# EAGLE design S7G7_footprint_Power_Meter_Only_v1p20 (EAGLE 9.6.2)
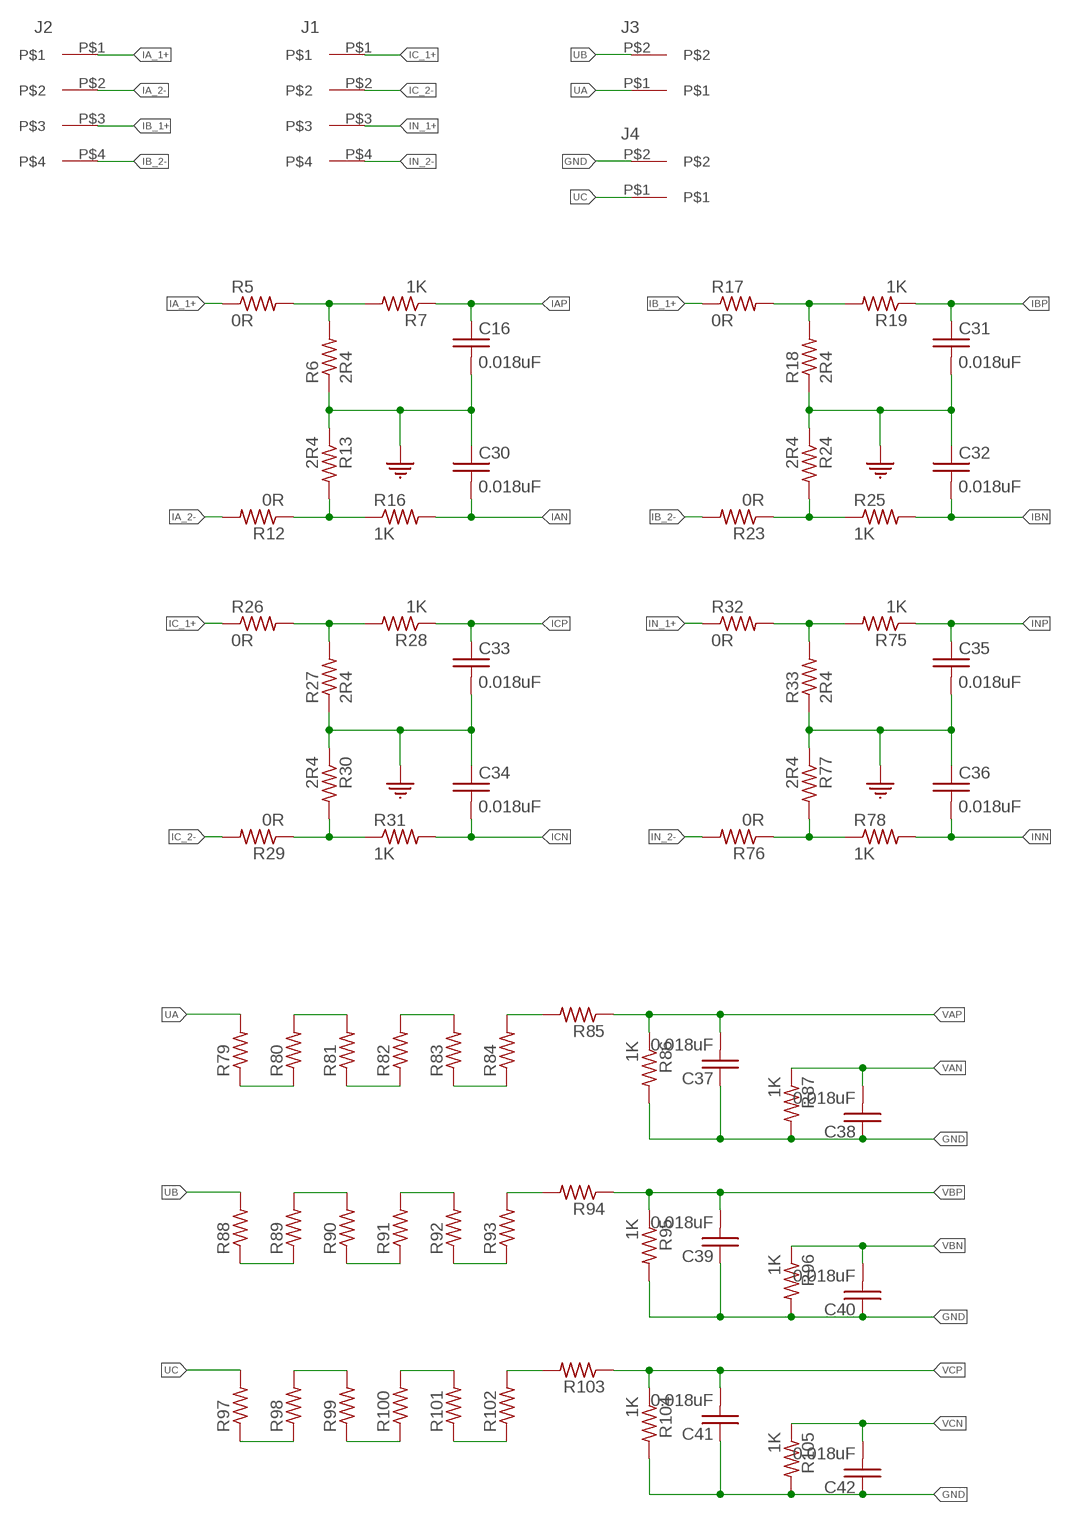
[diagram p0: schematic, sheet 1, part 1 of 2]
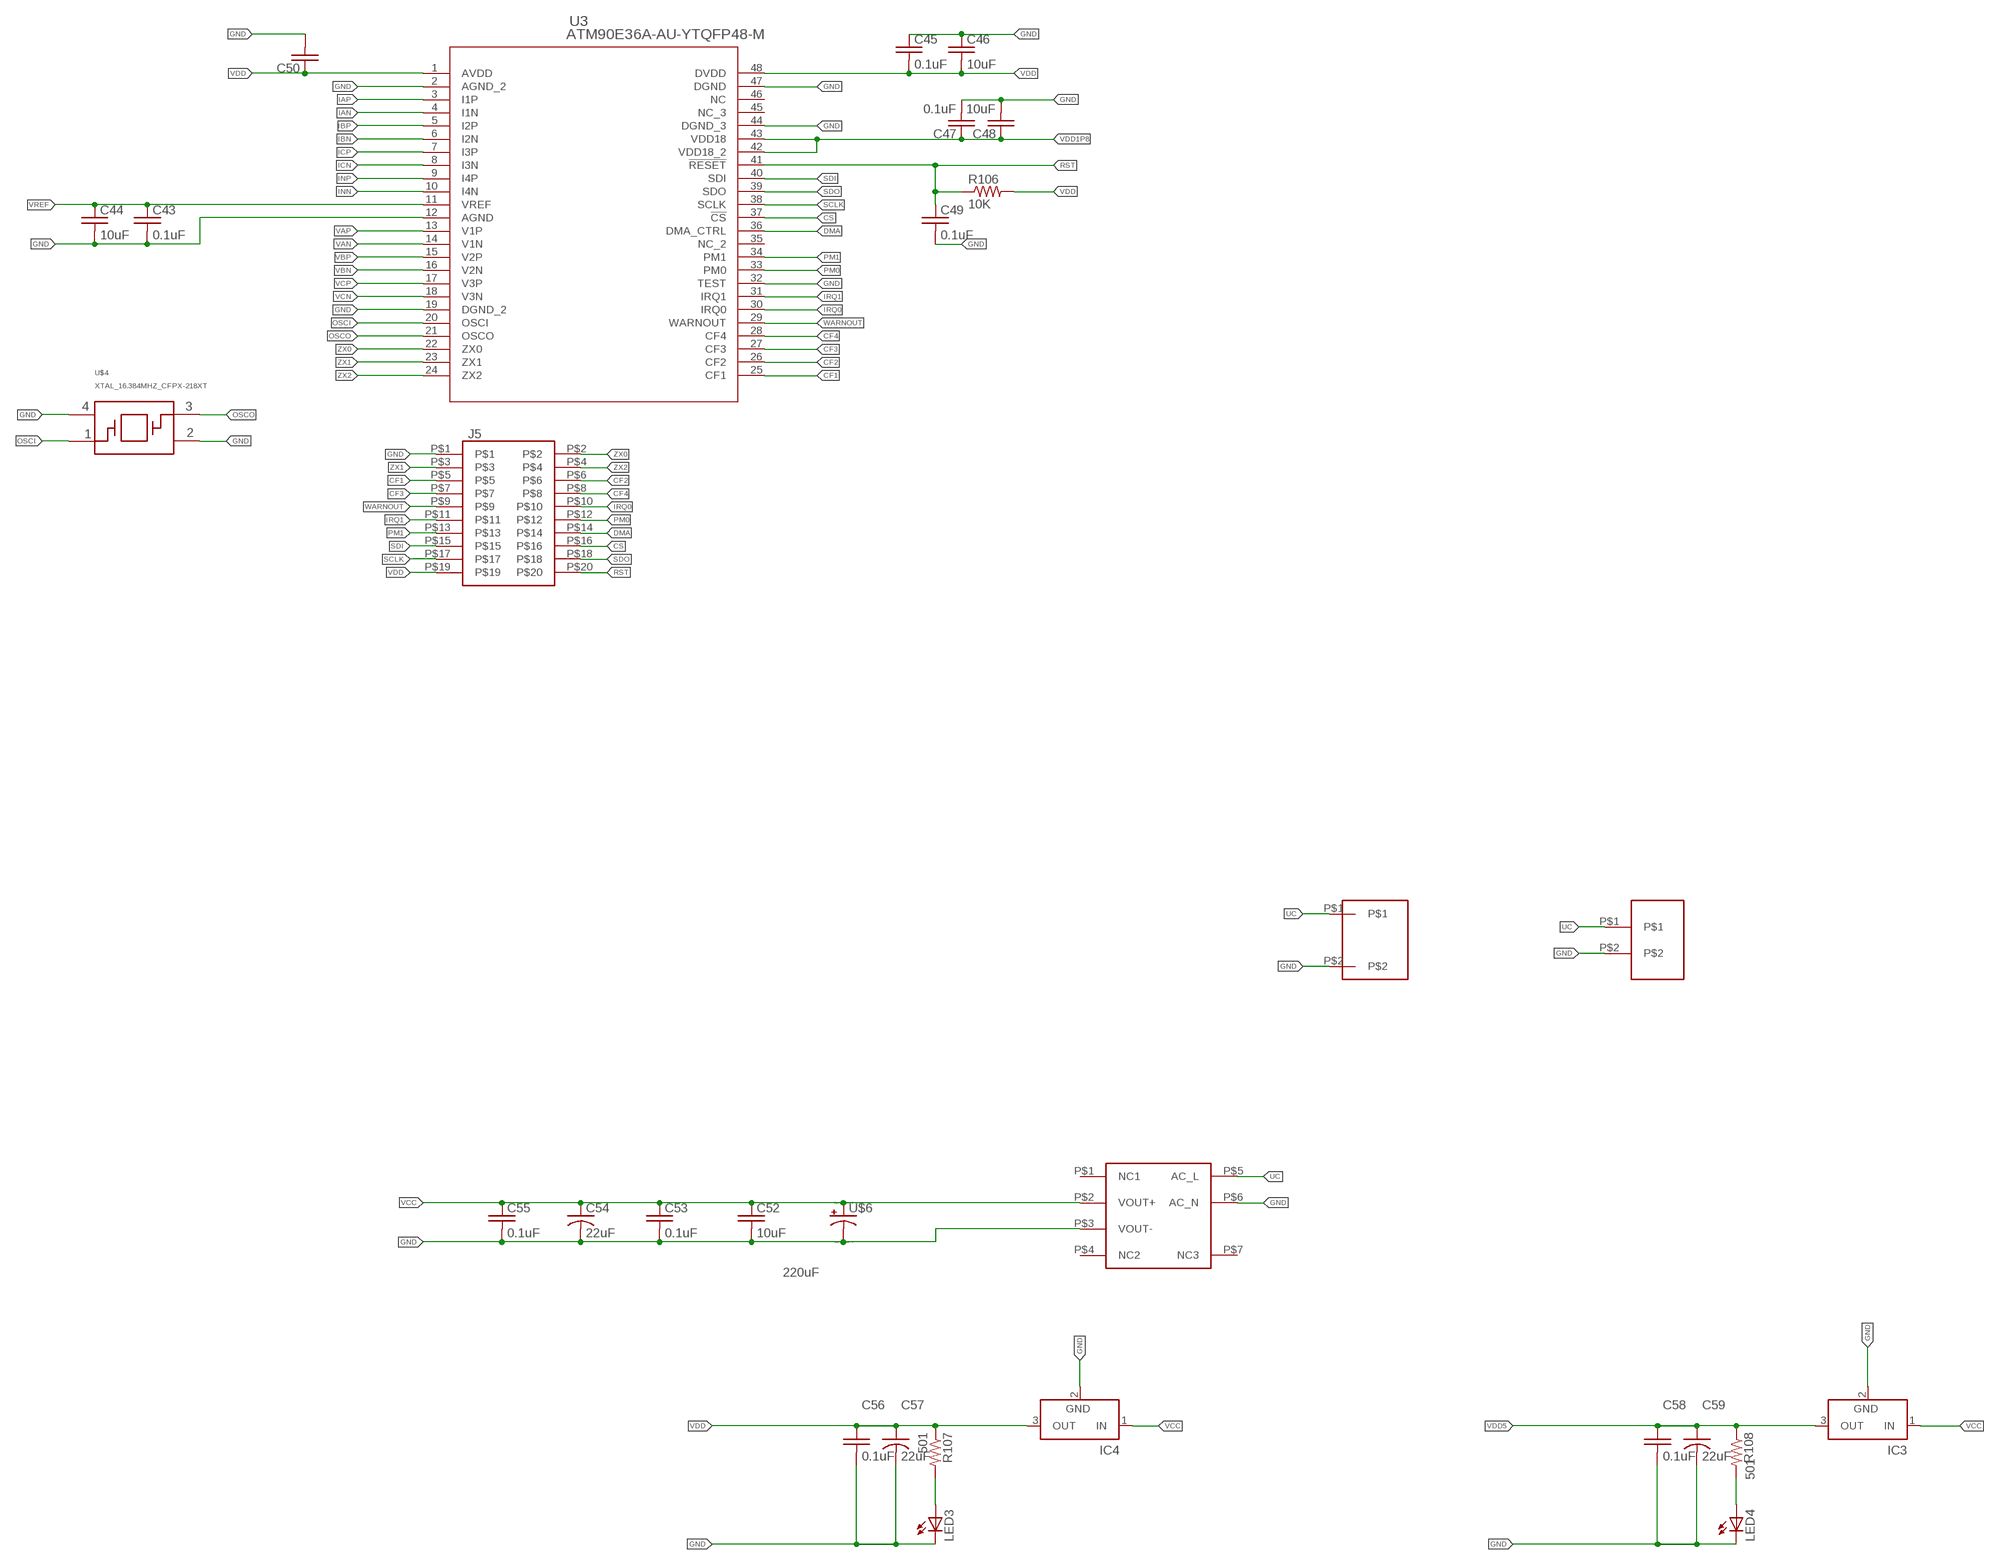
[diagram p1: schematic, sheet 1, part 2 of 2]

## Parts
C16  0.018uF  C_0402  [0402]
C30  0.018uF  C_0402  [0402]
C31  0.018uF  C_0402  [0402]
C32  0.018uF  C_0402  [0402]
C33  0.018uF  C_0402  [0402]
C34  0.018uF  C_0402  [0402]
C35  0.018uF  C_0402  [0402]
C36  0.018uF  C_0402  [0402]
C37  0.018uF  C_0402  [0402]
C38  0.018uF  C_0402  [0402]
C39  0.018uF  C_0402  [0402]
C40  0.018uF  C_0402  [0402]
C41  0.018uF  C_0402  [0402]
C42  0.018uF  C_0402  [0402]
C43  0.1uF  C_0402  [0402]
C44  10uF  C_0402  [0402]
C45  0.1uF  C_0402  [0402]
C46  10uF  C_0402  [0402]
C47  0.1uF  C_0402  [0402]
C48  10uF  C_0402  [0402]
C49  0.1uF  C_0402  [0402]
C50  C_0402  [0402]
C51  CAP_THIN_FILM_TDK_32922CAP  [CAP_THIN_FILM_32922]
C52  10uF  C_0402  [0402]
C53  0.1uF  C_0402  [0402]
C54  22uF  C-USC1206  [C1206]
C55  0.1uF  C_0402  [0402]
C56  0.1uF  C_0402  [0402]
C57  22uF  C-USC1206  [C1206]
C58  0.1uF  C_0402  [0402]
C59  22uF  C-USC1206  [C1206]
IC3  LT1129CST5  [SOT223]
IC4  LT1129CST3  [SOT223]
J1  3.81MM_1_X_4_RT_ANGLE_PLUG_HEADER  [1X4_3.81MM_PITCH]
J2  3.81MM_1_X_4_RT_ANGLE_PLUG_HEADER  [1X4_3.81MM_PITCH]
J3  3.81MM_1_X_2_RT_ANGLE_PLUG_HEADER  [2_3.81MM_PITCH]
J4  3.81MM_1_X_2_RT_ANGLE_PLUG_HEADER  [2_3.81MM_PITCH]
J5  2_X_10_HEADER_GENERIC  [2_X_10_.1_INCH]
LED3  LED_0805_GREEN  [LED_0805_GREEN]
LED4  LED_0805_GREEN  [LED_0805_GREEN]
R5  0R  R_0402  [0402]
R6  2R4  R_0402  [0402]
R7  1K  R_0402  [0402]
R12  0R  R_0402  [0402]
R13  2R4  R_0402  [0402]
R16  1K  R_0402  [0402]
R17  0R  R_0402  [0402]
R18  2R4  R_0402  [0402]
R19  1K  R_0402  [0402]
R23  0R  R_0402  [0402]
R24  2R4  R_0402  [0402]
R25  1K  R_0402  [0402]
R26  0R  R_0402  [0402]
R27  2R4  R_0402  [0402]
R28  1K  R_0402  [0402]
R29  0R  R_0402  [0402]
R30  2R4  R_0402  [0402]
R31  1K  R_0402  [0402]
R32  0R  R_0402  [0402]
R33  2R4  R_0402  [0402]
R75  1K  R_0402  [0402]
R76  0R  R_0402  [0402]
R77  2R4  R_0402  [0402]
R78  1K  R_0402  [0402]
R79  R_0402  [0402]
R80  R_0402  [0402]
R81  R_0402  [0402]
R82  R_0402  [0402]
R83  R_0402  [0402]
R84  R_0402  [0402]
R85  R_0402  [0402]
R86  1K  R_0402  [0402]
R87  1K  R_0402  [0402]
R88  R_0402  [0402]
R89  R_0402  [0402]
R90  R_0402  [0402]
R91  R_0402  [0402]
R92  R_0402  [0402]
R93  R_0402  [0402]
R94  R_0402  [0402]
R95  1K  R_0402  [0402]
R96  1K  R_0402  [0402]
R97  R_0402  [0402]
R98  R_0402  [0402]
R99  R_0402  [0402]
R100  R_0402  [0402]
R101  R_0402  [0402]
R102  R_0402  [0402]
R103  R_0402  [0402]
R104  1K  R_0402  [0402]
R105  1K  R_0402  [0402]
R106  10K  R_0402  [0402]
R107  501  R_0402  [0402]
R108  501  R_0402  [0402]
U3  ATM90E36A-AU-YTQFP48-M  [TQFP48-M]
U4  TMLM_04109  [TMLM04]
U$4  XTAL_16.384MHZ_CFPX-218XT  [XTAL_2.5X2.0]
U$5  VAR_10MM_VDRUS10  [VAR_10MM_VDRUS10]
U$6  220uF  C_AL_ELECTROLYTIC_SMD_220UF  [C_AL_ELECTROLYTIC_SMD_220UF]

## Nets
CF1: J5.P$5 U3.25(CF1)
CF2: J5.P$6 U3.26(CF2)
CF3: J5.P$7 U3.27(CF3)
CF4: J5.P$8 U3.28(CF4)
CS: J5.P$16 U3.37(!CS)
DMA: J5.P$14 U3.36(DMA_CTRL)
GND: C16.P$2 C30.P$1 C31.P$2 C32.P$1 C33.P$2 C34.P$1 C35.P$2 C36.P$1 C37.P$1 C38.P$1 C39.P$1 C40.P$1 C41.P$1 C42.P$1 C43.P$2 C44.P$2 C45.P$1 C46.P$1 C47.P$2 C48.P$2 C49.P$2 C50.P$2 C51.P$2 C52.P$2 C53.P$2 C54.2 C55.P$2 C56.P$2 C57.2 C58.P$2 C59.2 IC3.2(GND) IC4.2(GND) J4.P$2 J5.P$1 LED3.C LED4.C R6.P$1 R13.P$1 R18.P$1 R24.P$1 R27.P$1 R30.P$1 R33.P$1 R77.P$1 R86.P$2 R87.P$2 R95.P$2 R96.P$2 R104.P$2 R105.P$2 U3.2(AGND_2) U3.12(AGND) U3.19(DGND_2) U3.32(TEST) U3.44(DGND_3) U3.47(DGND) U4.P$3(VOUT-) U4.P$6(AC_N) U$4.2 U$4.4 U$5.P$2 U$6.N-(-)
IA_1+: J2.P$1 R5.P$1
IA_2-: J2.P$2 R12.P$2
IAN: C30.P$2 R16.P$2 U3.4(I1N)
IAP: C16.P$1 R7.P$1 U3.3(I1P)
IB_1+: J2.P$3 R17.P$1
IB_2-: J2.P$4 R23.P$2
IBN: C32.P$2 R25.P$2 U3.6(I2N)
IBP: C31.P$1 R19.P$1 U3.5(I2P)
IC_1+: J1.P$1 R26.P$1
IC_2-: J1.P$2 R29.P$2
ICN: C34.P$2 R31.P$2 U3.8(I3N)
ICP: C33.P$1 R28.P$1 U3.7(I3P)
IN_1+: J1.P$3 R32.P$1
IN_2-: J1.P$4 R76.P$2
INN: C36.P$2 R78.P$2 U3.10(I4N)
INP: C35.P$1 R75.P$1 U3.9(I4P)
IRQ0: J5.P$10 U3.30(IRQ0)
IRQ1: J5.P$11 U3.31(IRQ1)
N$4: R5.P$2 R6.P$2 R7.P$2
N$5: R12.P$1 R13.P$2 R16.P$1
N$6: R17.P$2 R18.P$2 R19.P$2
N$7: R23.P$1 R24.P$2 R25.P$1
N$8: R26.P$2 R27.P$2 R28.P$2
N$34: R29.P$1 R30.P$2 R31.P$1
N$35: R32.P$2 R33.P$2 R75.P$2
N$36: R76.P$1 R77.P$2 R78.P$1
N$37: R79.P$1 R80.P$1
N$38: R80.P$2 R81.P$2
N$39: R81.P$1 R82.P$1
N$40: R82.P$2 R83.P$2
N$41: R83.P$1 R84.P$1
N$42: R84.P$2 R85.P$2
N$43: R88.P$1 R89.P$1
N$44: R89.P$2 R90.P$2
N$45: R90.P$1 R91.P$1
N$46: R91.P$2 R92.P$2
N$47: R92.P$1 R93.P$1
N$48: R93.P$2 R94.P$2
N$49: R97.P$1 R98.P$1
N$50: R98.P$2 R99.P$2
N$51: R99.P$1 R100.P$1
N$52: R100.P$2 R101.P$2
N$53: R101.P$1 R102.P$1
N$54: R102.P$2 R103.P$2
N$55: LED3.A R107.P$2
N$56: LED4.A R108.P$2
OSCI: U3.20(OSCI) U$4.1
OSCO: U3.21(OSCO) U$4.3
PM0: J5.P$12 U3.33(PM0)
PM1: J5.P$13 U3.34(PM1)
RST: C49.P$1 J5.P$20 R106.P$1 U3.41(!RESET)
SCLK: J5.P$17 U3.38(SCLK)
SDI: J5.P$15 U3.40(SDI)
SDO: J5.P$18 U3.39(SDO)
UA: J3.P$1 R79.P$2
UB: J3.P$2 R88.P$2
UC: C51.P$1 J4.P$1 R97.P$2 U4.P$5(AC_L) U$5.P$1
VAN: C38.P$2 R87.P$1 U3.14(V1N)
VAP: C37.P$2 R85.P$1 R86.P$1 U3.13(V1P)
VBN: C40.P$2 R96.P$1 U3.16(V2N)
VBP: C39.P$2 R94.P$1 R95.P$1 U3.15(V2P)
VCC: C52.P$1 C53.P$1 C54.1 C55.P$1 IC3.1(IN) IC4.1(IN) U4.P$2(VOUT+) U$6.P+(+)
VCN: C42.P$2 R105.P$1 U3.18(V3N)
VCP: C41.P$2 R103.P$1 R104.P$1 U3.17(V3P)
VDD: C45.P$2 C46.P$2 C50.P$1 C56.P$1 C57.1 IC4.3(OUT) J5.P$19 R106.P$2 R107.P$1 U3.1(AVDD) U3.48(DVDD)
VDD1P8: C47.P$1 C48.P$1 U3.42(VDD18_2) U3.43(VDD18)
VDD5: C58.P$1 C59.1 IC3.3(OUT) R108.P$1
VREF: C43.P$1 C44.P$1 U3.11(VREF)
WARNOUT: J5.P$9 U3.29(WARNOUT)
ZX0: J5.P$2 U3.22(ZX0)
ZX1: J5.P$3 U3.23(ZX1)
ZX2: J5.P$4 U3.24(ZX2)
Unconnected: U3.35(NC_2) U3.45(NC_3) U3.46(NC) U4.P$1(NC1) U4.P$4(NC2) U4.P$7(NC3)

## Power pins joined to a net without a drawn wire
GND: IC3.4(GND) IC4.4(GND)

## Library data of the parts
C16 C30-C50 C52 C53 C55 C56 C58 = 3D_MIG_Controller:C_0402
C51 = 3D_MIG_Controller:CAP_THIN_FILM_TDK_32922
C54 C57 C59 = 3D_MIG_Controller:C-US: CAPACITOR, American symbol
IC3 = 3D_MIG_Controller:LT1129CST5: VOLTAGE REGULATOR with shutdown; MPN: LT1129CST-5#PBF; OC_FARNELL: 1663375; OC_NEWARK: 57M2069
IC4 = 3D_MIG_Controller:LT1129CST3: VOLTAGE REGULATOR with shutdown; MPN: LT1129CST-5#PBF; OC_FARNELL: 1663375; OC_NEWARK: 57M2069
J1 J2 = 3D_MIG_Controller:3.81MM_1_X_4_RT_ANGLE_PLUG_HEADER
J3 J4 = 3D_MIG_Controller:3.81MM_1_X_2_RT_ANGLE_PLUG_HEADER
J5 = 3D_MIG_Controller:2_X_10_HEADER_GENERIC
LED3 LED4 = 3D_MIG_Controller:LED_0805_GREEN
R5-R7 R12 R13 R16-R19 R23-R33 R75-R108 = 3D_MIG_Controller:R_0402
U3 = 3D_MIG_Controller:ATM90E36A-AU-Y; MANUFACTURER_PART_NUMBER: ATM90E36AAUY; VENDOR: Atmel
U4 = 3D_MIG_Controller:TMLM_04109
U$4 = 3D_MIG_Controller:XTAL_16.384MHZ_CFPX-218
U$5 = 3D_MIG_Controller:VAR_10MM_VDRUS10
U$6 = 3D_MIG_Controller:C_AL_ELECTROLYTIC_SMD_220UF

## Board
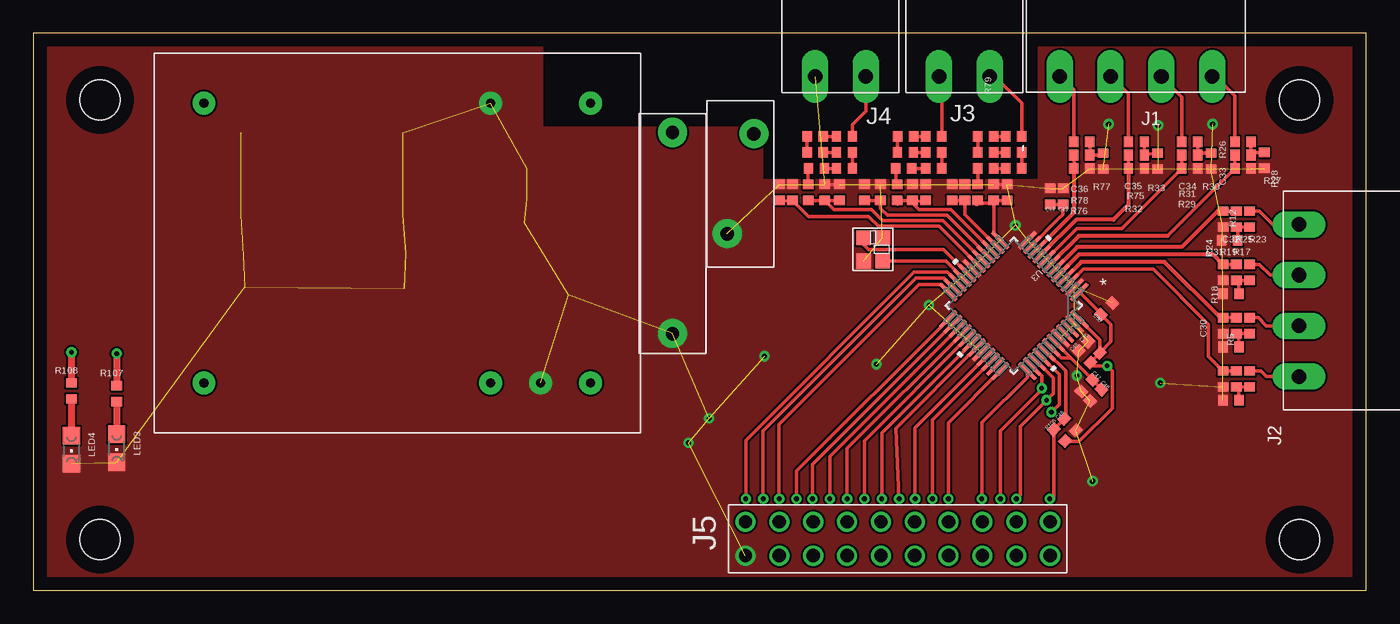
[diagram p2: board, top side]
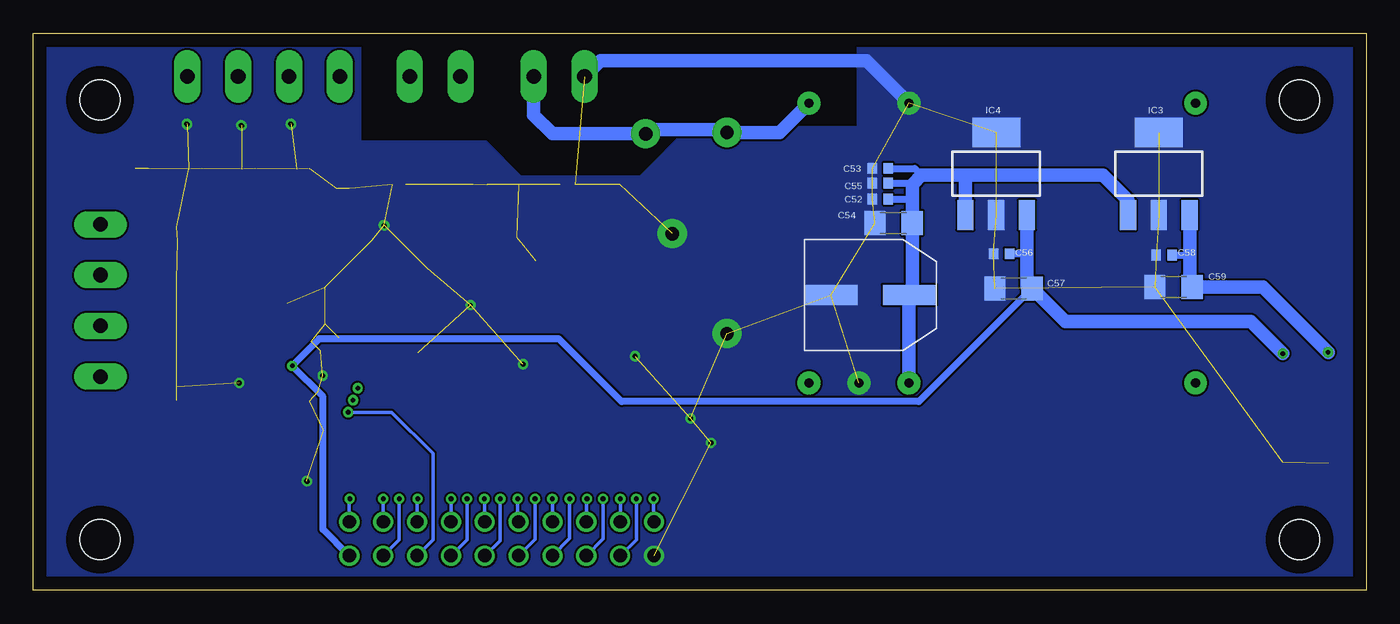
[diagram p3: board, bottom side, seen from below]

Size 100 x 41.8 mm. Coordinates in mm from the lower left corner, seen from the top.
Outline: 0,0 100,0 100,41.8 0,41.8 0,0
Copper layers (1*16): Top 0.035mm / dielectric 1.5mm / Bottom 0.035mm
Design rules "default": minimum track width 6mil, minimum drill 0.35mm, track to track 6mil, track to pad 6mil, pad to pad 6mil, via to via 6mil, smd to smd 6mil, copper to edge 40mil, drill to drill 6mil, minimum pad ring 10mil, minimum via ring 8mil, stop-mask expansion 4mil, vias tented up to drill 0mil, thermal gap 10mil
Holes 3 mm at 5,36.8 95,36.8 95,3.8 5,3.8

### Footprints (pad centres in the part's own frame; a part is rotated, then mirrored left to right if it is on the bottom)
0402 = smd 0.8 x 0.7: P$1 0,0.6; P$2 0,-0.6
CAP_THIN_FILM_32922 = drill 1 pad 2.184: P$1 -0.1,0; P$2 15,0
C1206 = smd 1.6 x 1.8: 1 -1.4,0; 2 1.4,0
SOT223 = smd 1.219 x 2.235: 1 -2.311,-3.099; 2 0,-3.099; 3 2.311,-3.099 | smd 3.6 x 2.2: 4 0,3.099
1X4_3.81MM_PITCH = drill 1.1 pad 2 long: P$1 0,0; P$2 3.81,0; P$3 7.62,0; P$4 11.43,0
2_3.81MM_PITCH = drill 1.1 pad 2 long: P$1 0,0; P$2 3.81,0
2_X_10_.1_INCH = drill 1: P$1 -11.43,-1.27; P$2 -11.43,1.27; P$3 -8.89,-1.27; P$4 -8.89,1.27; P$5 -6.35,-1.27; P$6 -6.35,1.27; P$7 -3.81,-1.27; P$8 -3.81,1.27; P$9 -1.27,-1.27; P$10 -1.27,1.27; P$11 1.27,-1.27; P$12 1.27,1.27; P$13 3.81,-1.27; P$14 3.81,1.27; P$15 6.35,-1.27; P$16 6.35,1.27; P$17 8.89,-1.27; P$18 8.89,1.27; P$19 11.43,-1.27; P$20 11.43,1.27
LED_0805_GREEN = smd 1.3 x 1.3: A 0,-1.05; C 0,1.05
TQFP48-M = smd 1.716 x 0.27: 1 -4.201,2.75; 2 -4.201,2.25; 3 -4.201,1.75; 4 -4.201,1.25; 5 -4.201,0.75; 6 -4.201,0.25; 7 -4.201,-0.25; 8 -4.201,-0.75; 9 -4.201,-1.25; 10 -4.201,-1.75; 11 -4.201,-2.25; 12 -4.201,-2.75; 25 4.201,-2.75; 26 4.201,-2.25; 27 4.201,-1.75; 28 4.201,-1.25; 29 4.201,-0.75; 30 4.201,-0.25; 31 4.201,0.25; 32 4.201,0.75; 33 4.201,1.25; 34 4.201,1.75; 35 4.201,2.25; 36 4.201,2.75 | smd 0.27 x 1.716: 13 -2.75,-4.201; 14 -2.25,-4.201; 15 -1.75,-4.201; 16 -1.25,-4.201; 17 -0.75,-4.201; 18 -0.25,-4.201; 19 0.25,-4.201; 20 0.75,-4.201; 21 1.25,-4.201; 22 1.75,-4.201; 23 2.25,-4.201; 24 2.75,-4.201; 37 2.75,4.201; 38 2.25,4.201; 39 1.75,4.201; 40 1.25,4.201; 41 0.75,4.201; 42 0.25,4.201; 43 -0.25,4.201; 44 -0.75,4.201; 45 -1.25,4.201; 46 -1.75,4.201; 47 -2.25,4.201; 48 -2.75,4.201
TMLM04 = drill 0.7 pad 1.7: P$1 21,-25.25; P$2 21,-3.75; P$3 21,0; P$4 21,3.75; P$5 0,3.75; P$6 0,-3.75; P$7 0,-25.25
XTAL_2.5X2.0 = smd 1.1 x 1.1: 1 -0.875,-0.713; 2 0.875,-0.713; 3 0.875,0.713; 4 -0.875,0.713
VAR_10MM_VDRUS10 = drill 1 pad 2.184: P$1 0,1; P$2 7.5,-1
C_AL_ELECTROLYTIC_SMD_220UF = smd 1.5 x 4: N- 0,2; P+ 0,7.9

### Placement (x,y rotation side)
C16  89.26,15.86 0 top
C30  89.26,19.86 180 top
C31  89.26,23.86 0 top
C32  89.26,27.86 180 top
C33  90.76,31.66 90 top
C34  86.76,31.66 270 top
C35  82.76,31.66 90 top
C36  78.66,31.66 270 top
C37  73.06,29.86 0 top
C38  68.93,29.86 0 top
C39  65.96,29.86 0 top
C40  63.56,29.86 0 top
C41  60.48,29.86 0 top
C42  55.99,29.86 0 top
C43  77.26,29.56 180 top
C44  76.28,29.56 180 top
C45  79.59,18.23 45 top
C46  78.87,17.53 45 top
C47  79.04,15.35 315 top
C48  79.71,14.63 315 top
C49  77.79,12.43 45 top
C50  80.53,21.13 135 top
C51  47.96,34.26 270 top
C52  36.46,29.36 270 bottom
C53  36.46,31.66 270 bottom
C54  35.46,27.56 180 bottom
C55  36.46,30.56 270 bottom
C56  27.36,25.26 270 bottom
C57  26.46,22.66 180 bottom
C58  15.16,25.16 270 bottom
C59  14.46,22.76 180 bottom
IC3  15.56,31.26 0 bottom
IC4  27.76,31.26 0 bottom
J1  88.44,38.57 180 top
J2  94.97,16.03 90 top
J3  71.76,38.56 180 top
J4  62.46,38.56 180 top
J5  64.86,3.86 0 top
LED3  6.26,10.66 180 top
LED4  2.86,10.56 180 top
R5  91.26,15.86 0 top
R6  89.86,14.26 90 top
R7  90.26,15.86 0 top
R12  91.26,19.86 180 top
R13  89.86,18.26 90 top
R16  90.26,19.86 180 top
R17  91.26,23.86 0 top
R18  89.86,22.26 90 top
R19  90.26,23.86 0 top
R23  91.26,27.86 180 top
R24  89.76,26.26 90 top
R25  90.26,27.86 180 top
R26  90.76,33.66 90 top
R27  92.36,32.26 180 top
R28  90.76,32.66 90 top
R29  86.76,33.66 270 top
R30  88.36,32.21 180 top
R31  86.76,32.66 270 top
R32  82.76,33.66 90 top
R33  84.36,32.21 180 top
R75  82.76,32.66 90 top
R76  78.66,33.66 270 top
R77  80.26,32.2 180 top
R78  78.66,32.66 270 top
R79  73.56,34.06 90 top
R80  71.46,34.06 270 top
R81  71.46,32.86 270 top
R82  73.56,32.86 90 top
R83  73.56,31.66 90 top
R84  71.46,31.66 270 top
R85  70.86,29.86 180 top
R86  72.06,29.86 180 top
R87  69.89,29.86 180 top
R88  67.56,34.06 90 top
R89  65.46,34.06 270 top
R90  65.43,32.86 270 top
R91  67.56,32.86 90 top
R92  67.56,31.66 90 top
R93  65.31,31.66 270 top
R94  64.81,29.86 180 top
R95  66.96,29.86 180 top
R96  62.36,29.86 180 top
R97  60.86,34.06 90 top
R98  58.66,34.06 270 top
R99  58.66,32.86 270 top
R100  60.86,32.86 90 top
R101  60.86,31.66 90 top
R102  58.76,31.66 270 top
R103  58.13,29.86 180 top
R104  59.37,29.86 180 top
R105  56.96,29.86 180 top
R106  76.99,11.63 45 top
R107  6.26,14.76 0 top
R108  2.86,14.96 0 top
U3  73.56,21.36 225 top
U4  38.06,36.56 270 top
U$4  63,25.58 270 top
U$5  53.06,34.26 270 top
U$6  42.16,22.16 270 bottom

### Tracks (layer width: path | path; a pad name or v marks a point on that pad's centre or on a via)
CF1  (via drill 0.35)
  Top 0.254: U3.25 57.26,8.95 v57.26,6.86
  Bottom 0.254: v57.26,6.86 57.26,3.84 J5.P$5
CF2  (via drill 0.35)
  Top 0.254: U3.26 58.46,9.44 v58.46,6.86
  Bottom 0.254: v58.46,6.86 58.51,6.81 J5.P$6
CF3  (via drill 0.35)
  Top 0.254: U3.27 59.76,10.03 v59.76,6.86
  Bottom 0.254: v59.76,6.86 59.76,3.88 J5.P$7
CF4  (via drill 0.35)
  Top 0.254: U3.28 61.06,10.63 v61.06,6.86
  Bottom 0.254: v61.06,6.86 J5.P$8
CS  (via drill 0.35)
  Top 0.254: U3.37 74.56,16.42 74.56,15.97 71.21,12.61 71.16,12.61 v71.16,6.86
  Bottom 0.254: J5.P$16 71.21,6.86 v71.16,6.86
DMA  (via drill 0.35)
  Top 0.254: U3.36 68.64,12.56 68.66,12.55 v68.66,6.86
  Bottom 0.254: v68.66,6.86 J5.P$14
GND  (via drill 0.35)  (78 unrouted)
  Top 0.254: R104.P$2 C41.P$1 | R86.P$2 C37.P$1
  Top 0.508: C39.P$1 65.97,30.41
  Bottom 1.016: J4.P$2 57.45,39.76 37.51,39.76 U4.P$6
  other vias: 79.5,8.2 67.2,21.4 78.3,16.1 73.7,27.4 50.7,12.9 80.7,35 84.4,34.9 88.5,35 79.46,8.16 63.26,16.96 84.56,15.56 73.66,27.36 54.86,17.56 49.16,11.06 80.66,34.96 84.36,34.86 88.46,34.96
  pour Top (no thermals): -1,43.1 38.2,43.1 38.2,34.8 54.7,34.8 54.7,30.86 75.4,30.86 75.4,42.9 106.2,42.9 106.2,-62.4 -1,-62.4
  pour Bottom (no thermals): -1,43.1 38.2,43.1 38.2,34.8 50.8,34.8 54.5,31.1 63.4,31.1 66,33.7 75.4,33.7 75.4,42.9 106.2,42.9 106.2,-62.5 -1,-62.5
  pour Bottom (no thermals): 63.36,31.06 65.96,33.66 75.36,33.66
IA_1+
  Top 0.254: R5.P$1 92.09,16.46 92.52,16.03 J2.P$1
IA_2-
  Top 0.254: R12.P$2 91.89,20.46 92.51,19.84 J2.P$2
IAN
  Top 0.254: R16.P$2 C30.P$2
  Top 0.305: U3.4 78.61,24.65 84.87,24.65 89.06,20.46 C30.P$2
IAP
  Top 0.254: R7.P$1 C16.P$1 88.16,17.56 88.16,19.96 84.03,24.09 78.77,24.09 U3.3
IB_1+
  Top 0.254: R17.P$1 91.99,24.46 92.8,23.65 J2.P$3
IB_2-
  Top 0.254: R23.P$2 91.99,28.46 92.99,27.46 J2.P$4
IBN
  Top 0.254: R25.P$2 C32.P$2
  Top 0.305: U3.6 78.31,25.76 86.16,25.76 88.86,28.46 C32.P$2
IBP
  Top 0.254: R19.P$1 C31.P$1
  Top 0.305: U3.5 78.46,25.2 88.52,25.2 C31.P$1
IC_1+
  Top 0.254: R26.P$1 90.16,37.11 88.7,38.57 J1.P$1
IC_2-
  Top 0.254: R29.P$2 86.16,37.01 84.63,38.54 J1.P$2
ICN
  Top 0.254: R31.P$2 C34.P$2 81.66,27.16 78.3,27.16 U3.8
ICP
  Top 0.254: R28.P$1 C33.P$1 85.09,26.59
  Top 0.305: 85.09,26.59 78.43,26.59 U3.7
IN_1+
  Top 0.254: R32.P$1 82.16,37.26 80.85,38.57 J1.P$3
IN_2-
  Top 0.254: R76.P$2 78.06,37.56 77.05,38.57 J1.P$4
INN
  Top 0.254: R78.P$2 78.09,31.63 C36.P$2
  Top 0.305: C36.P$2 78.06,28.33 U3.10
INP
  Top 0.254: R75.P$1 82.19,31.5 C35.P$1
  Top 0.305: C35.P$1 82.16,28.93 81.05,27.81 78.25,27.81 U3.9
IRQ0  (via drill 0.35)
  Top 0.254: U3.30 63.66,11.81 v63.66,6.86
  Bottom 0.254: v63.66,6.86 63.66,5.2 J5.P$10
IRQ1  (via drill 0.35)
  Top 0.254: U3.31 64.71,12.16 v64.96,6.86
  Bottom 0.254: v64.96,6.86 65,6.82 65,3.72 J5.P$11
N$4
  Top 0.254: R5.P$2 R7.P$2 90.46,15.06 R6.P$2
N$5
  Top 0.254: R13.P$2 90.46,19.06 R16.P$1 R12.P$1
N$6
  Top 0.254: R18.P$2 90.46,23.06 R19.P$2 R17.P$2
N$7
  Top 0.254: R24.P$2 90.36,27.16 R25.P$1 R23.P$1
N$8
  Top 0.254: R27.P$2 91.56,32.86 R28.P$2 R26.P$2
N$34
  Top 0.254: R29.P$1 R31.P$1 87.51,32.81 R30.P$2
N$35
  Top 0.254: R32.P$2 83.4,32.53 R75.P$2 83.39,32.69 R33.P$2
N$36
  Top 0.254: R77.P$2 80.26,32.66 R78.P$1 79.3,32.63 R76.P$1
N$37
  Top 0.254: R80.P$1 R79.P$1
N$38
  Top 0.254: R81.P$2 R80.P$2
N$39
  Top 0.254: R82.P$1 R81.P$1
N$40
  Top 0.254: R83.P$2 R82.P$2
N$41
  Top 0.254: R84.P$1 R83.P$1
N$42
  Top 0.254: R85.P$2 R84.P$2
N$43
  Top 0.254: R89.P$1 R88.P$1
N$44
  Top 0.254: R90.P$2 64.83,33.73 R89.P$2
N$45
  Top 0.254: R91.P$1 R90.P$1
N$46
  Top 0.254: R92.P$2 R91.P$2
N$47
  Top 0.254: R93.P$1 R92.P$1
N$48
  Top 0.254: R94.P$2 64.71,30.46 R93.P$2
N$49
  Top 0.254: R98.P$1 R97.P$1
N$50
  Top 0.254: R99.P$2 R98.P$2
N$51
  Top 0.254: R100.P$1 R99.P$1
N$52
  Top 0.254: R101.P$2 R100.P$2
N$53
  Top 0.254: R102.P$1 R101.P$1
N$54
  Top 0.254: R103.P$2 58.13,31.33 R102.P$2
N$55
  Top 0.508: R107.P$2 LED3.A
N$56
  Top 0.508: R108.P$2 LED4.A
OSCI
  Top 0.254: U3.20 68.28,25.58 62.65,25.58 62.29,25.94 U$4.1
OSCO
  Top 0.254: U$4.3 68.45,24.7 U3.21
PM0  (via drill 0.35)
  Top 0.254: U3.33 66.16,12.19 v66.16,6.86
  Bottom 0.254: v66.16,6.86 66.16,5.16 J5.P$12
PM1  (via drill 0.35)
  Top 0.254: U3.34 67.45,12.78 67.46,12.77 v67.46,6.86
  Bottom 0.254: v67.46,6.86 67.46,3.8 J5.P$13
RST  (via drill 0.35)
  Top 0.254: v76.26,6.86 76.56,6.86 R106.P$1 C49.P$1 77.47,12.95 77.47,16.45 76.06,17.86 U3.41
  Bottom 0.254: J5.P$20 76.29,6.83 v76.26,6.86
SCLK  (via drill 0.35)
  Top 0.254: U3.38 75.66,16.08 v75.66,15.16 75.66,15.06 72.55,11.95 v72.55,6.86
  Bottom 0.254: v72.55,6.86 72.55,3.79 J5.P$17
SDI  (via drill 0.35)
  Top 0.254: U3.40 76.97,16.18 76.97,13.96 v76.38,13.36
  Bottom 0.254: v76.38,13.36 73.11,13.36 70.01,10.26 70.01,3.79 J5.P$15
SDO  (via drill 0.35)
  Top 0.254: U3.39 76.52,15.93 76.52,14.76 v76.02,14.26 74.05,12.29 74.05,7.16 v73.75,6.86
  Bottom 0.254: J5.P$18 v73.75,6.86
UA
  Top 0.254: R79.P$2 74.16,36.56 72.16,38.56 J3.P$1
UB
  Top 0.254: R88.P$2 68.16,36.74 67.95,36.95 J3.P$2
UC
  Top 0.254: J4.P$1 62.46,35.96 61.46,34.96 R97.P$2
  Bottom 1.016: J4.P$1 62.46,35.66 61.06,34.26 U$5.P$1 53.76,34.56 47.96,34.56 C51.P$1 44.01,34.36 U4.P$5
VAN
  Top 0.254: U3.14 69.89,28.21 R87.P$1 C38.P$2
VAP
  Top 0.254: R86.P$1 72.06,26.75 U3.13 | C37.P$2 R86.P$1 | R86.P$1 71.96,29.06 70.76,29.06
  Top 0.508: 70.76,29.06 R85.P$1
VBN
  Top 0.254: U3.16 68.54,28.15 64.07,28.15 63.56,28.66 C40.P$2 R96.P$1
VBP
  Top 0.254: U3.15 68.83,28.57 66.45,28.57 65.96,29.06 C39.P$2 | C39.P$2 R94.P$1 | C39.P$2 66.91,29.16 66.95,29.2
  Top 0.508: R94.P$1 64.86,29.11 | 65.93,29.23 C39.P$2 | 66.95,29.2 R95.P$1
VCC
  Bottom 0.508: C53.P$1 33.86,31.66 33.36,31.16 | C55.P$1 34.16,30.56 34.06,30.46 | C52.P$1 34.16,29.36 34.06,29.46
  Bottom 1.016: U4.P$2 34.31,22.11 U$6.P+ 34.06,22.36 C54.1 34.06,29.46 34.06,30.46 33.36,31.16 30.07,31.16 | 30.07,31.16 IC4.1 | 30.07,31.16 19.76,31.16 17.87,29.27 IC3.1
VCN
  Top 0.254: U3.18 67.95,27.32 63.39,27.32 62.65,28.06 58.16,28.06 R105.P$1 56.93,29.19 C42.P$2
VCP
  Top 0.254: U3.17 68.25,27.73 63.7,27.73 62.87,28.56 60.07,28.56 R104.P$1 | C41.P$2 R104.P$1 | R104.P$1 R103.P$1
VDD  (via drill 0.35)
  Top 0.254: U3.1 80.11,20.75 C50.P$1 80.86,19.95 80.86,18.65 C45.P$2 | C45.P$2 79.32,17.11 C46.P$2 79.56,16.84 v80.58,16.84 80.96,16.46 80.96,13.66 78.46,11.16 77.46,11.16 R106.P$2 | C45.P$2 80.02,18.79 U3.48
  Top 0.508: v6.26,17.76 R107.P$1
  Bottom 0.508: J5.P$19 78.26,4.56 78.26,14.53 v80.58,16.84 78.56,18.86 60.56,18.86 55.86,14.16 33.56,14.16 25.16,22.56 | C57.1 25.16,22.56 | IC4.3 | 25.46,22.86 25.16,22.56 | C56.P$1 25.55,25.26 25.45,25.36
  Bottom 1.016: C57.1 22.56,20.16 8.66,20.16 v6.26,17.76 | IC4.3 25.45,25.36 25.45,22.85 25.16,22.56
VDD1P8
  Top 0.254: 76.35,18.19 U3.42 77.13,17.43 77.83,17.43 | 77.83,17.43 79.46,15.8 C47.P$1 80.13,15.11 C48.P$1 | 77.83,17.43 U3.43
VDD5  (via drill 0.35)
  Top 0.508: v2.86,17.86 R108.P$1
  Bottom 0.508: 14.65,25.25 C58.P$1 13.35,25.16 13.25,25.26 | 13.16,22.86 C59.1
  Bottom 1.016: 13.01,22.81 C59.1 7.76,22.76 v2.86,17.86 | IC3.3 13.25,25.26 13.25,22.95 13.16,22.86
VREF
  Top 0.254: U3.11 76.88,27.86 77.26,28.19 C43.P$1 C44.P$1
WARNOUT  (via drill 0.35)
  Top 0.254: U3.29 62.36,11.22 v62.36,6.86
  Bottom 0.254: v62.36,6.86 62.36,3.82 J5.P$9
ZX0  (via drill 0.35)
  Top 0.254: U3.22 68.58,23.86 66.06,23.86 53.46,11.26 v53.46,6.86
  Bottom 0.254: v53.46,6.86 53.46,5.16 J5.P$2
ZX1  (via drill 0.35)
  Top 0.254: U3.23 68.32,23.42 66.22,23.42 54.76,11.96 v54.76,6.86
  Bottom 0.254: v54.76,6.86 54.76,3.8 J5.P$3
ZX2  (via drill 0.35)
  Top 0.254: U3.24 68.07,22.96 66.46,22.96 55.96,12.46 v55.96,6.86
  Bottom 0.254: v55.96,6.86 J5.P$4